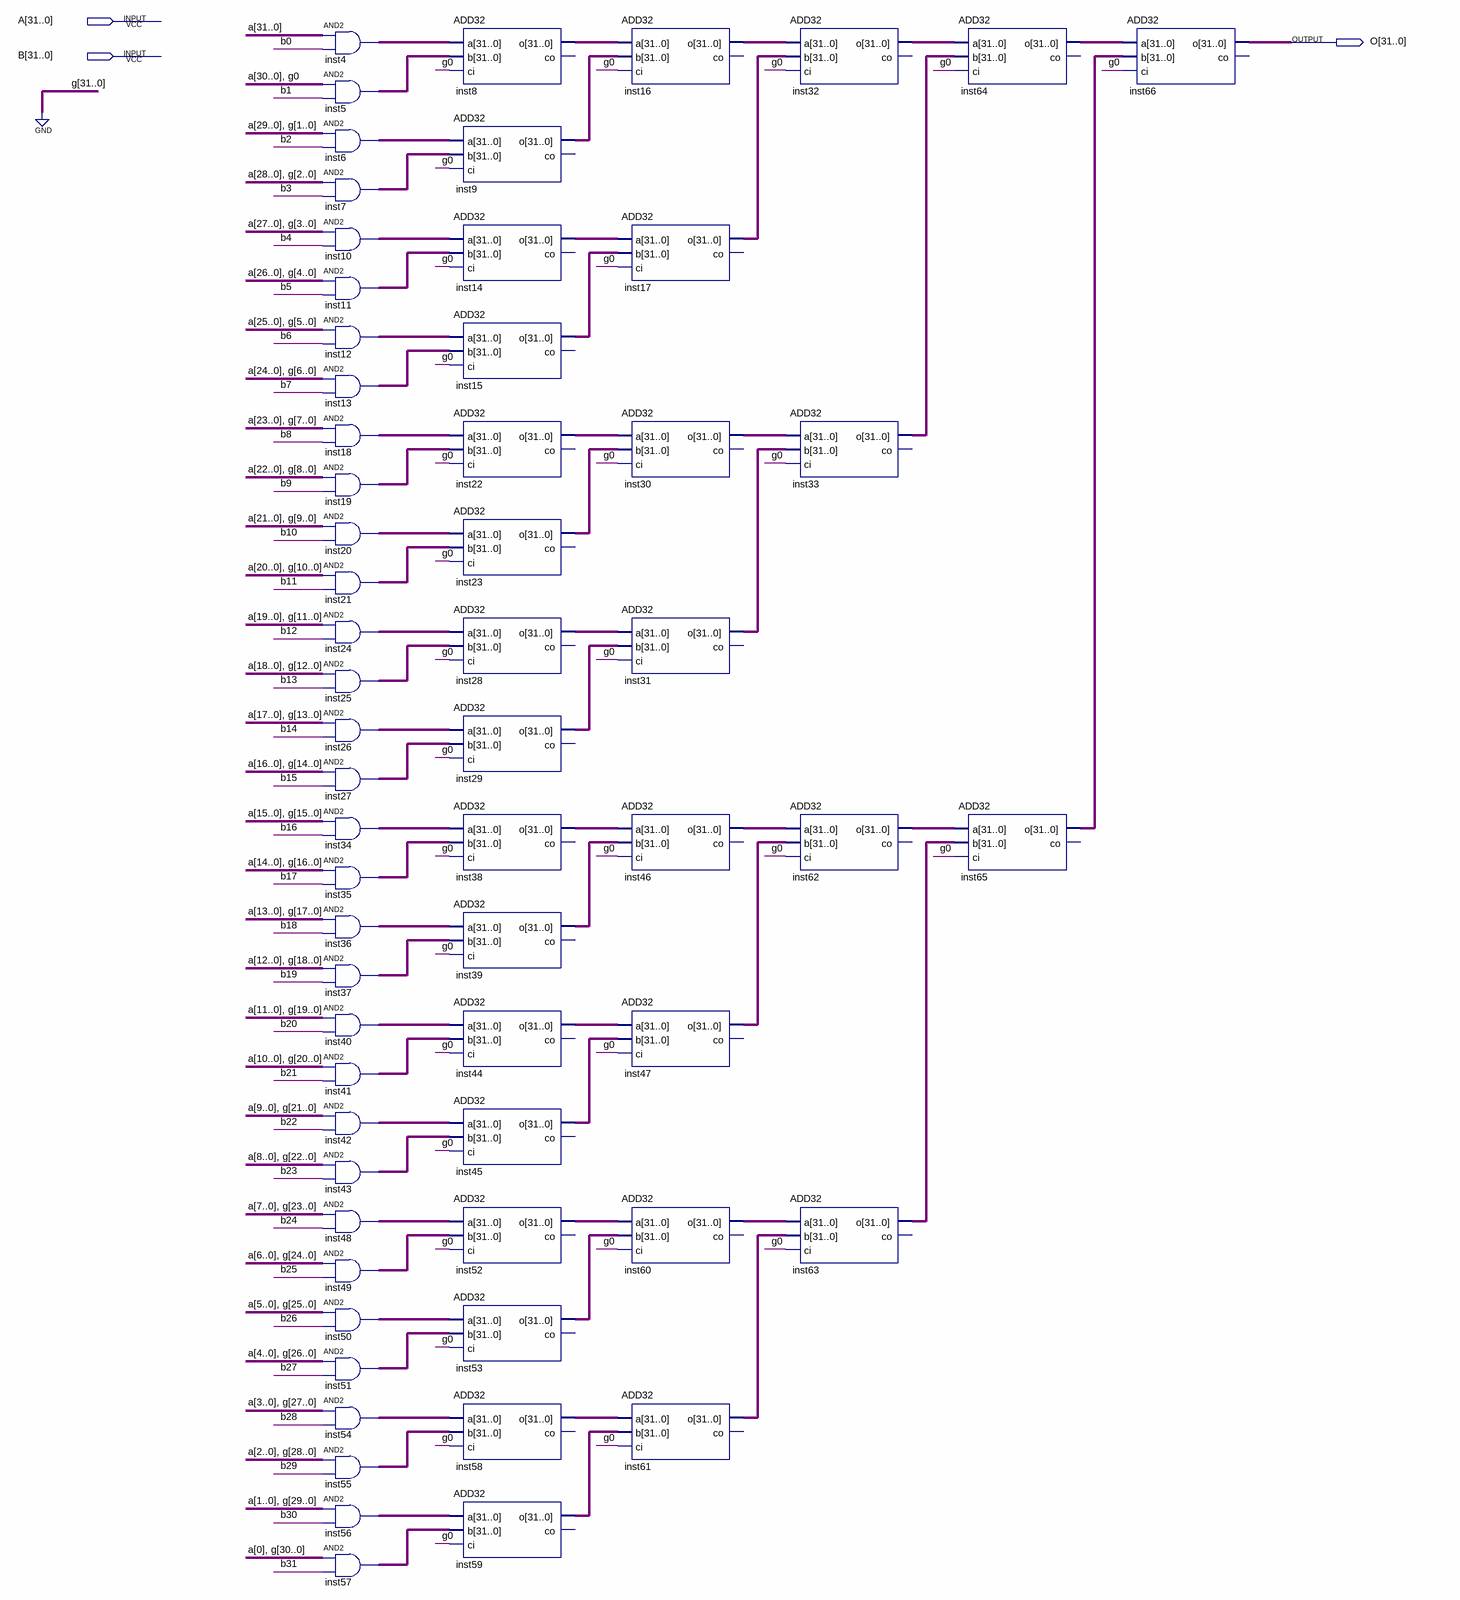
[diagram p0: schematic sheet]
// Quartus schematic MUL32.bdf as structural Verilog: 63 symbols, 3 pins
module MUL32 (
  input  [31:0] A,
  input  [31:0] B,
  output [31:0] O
);

  wire [31:0] inst4_out, inst5_out, inst6_out, inst7_out, inst8_o, inst9_o, inst10_out, inst11_out,
       inst12_out, inst13_out, inst14_o, inst15_o, inst16_o, inst17_o, inst18_out, inst19_out, inst20_out,
       inst21_out, inst22_o, inst23_o, inst24_out, inst25_out, inst26_out, inst27_out, inst28_o, inst29_o,
       inst30_o, inst31_o, inst32_o, inst33_o, inst34_out, inst35_out, inst36_out, inst37_out, inst38_o,
       inst39_o, inst40_out, inst41_out, inst42_out, inst43_out, inst44_o, inst45_o, inst46_o, inst47_o,
       inst48_out, inst49_out, inst50_out, inst51_out, inst52_o, inst53_o, inst54_out, inst55_out,
       inst56_out, inst57_out, inst58_o, inst59_o, inst60_o, inst61_o, inst62_o, inst63_o, inst64_o, inst65_o;

  assign inst4_out = A & {32{B[0]}};  // AND2 inst4, 32 bits wide
  assign inst5_out = {A[30:0], 1'b0} & {32{B[1]}};  // AND2 inst5, 32 bits wide
  assign inst6_out = {A[29:0], 2'b00} & {32{B[2]}};  // AND2 inst6, 32 bits wide
  assign inst7_out = {A[28:0], 3'b000} & {32{B[3]}};  // AND2 inst7, 32 bits wide
  assign inst10_out = {A[27:0], 4'b0000} & {32{B[4]}};  // AND2 inst10, 32 bits wide
  assign inst11_out = {A[26:0], {5{1'b0}}} & {32{B[5]}};  // AND2 inst11, 32 bits wide
  assign inst12_out = {A[25:0], {6{1'b0}}} & {32{B[6]}};  // AND2 inst12, 32 bits wide
  assign inst13_out = {A[24:0], {7{1'b0}}} & {32{B[7]}};  // AND2 inst13, 32 bits wide
  assign inst18_out = {A[23:0], {8{1'b0}}} & {32{B[8]}};  // AND2 inst18, 32 bits wide
  assign inst19_out = {A[22:0], {9{1'b0}}} & {32{B[9]}};  // AND2 inst19, 32 bits wide
  assign inst20_out = {A[21:0], {10{1'b0}}} & {32{B[10]}};  // AND2 inst20, 32 bits wide
  assign inst21_out = {A[20:0], {11{1'b0}}} & {32{B[11]}};  // AND2 inst21, 32 bits wide
  assign inst24_out = {A[19:0], {12{1'b0}}} & {32{B[12]}};  // AND2 inst24, 32 bits wide
  assign inst25_out = {A[18:0], {13{1'b0}}} & {32{B[13]}};  // AND2 inst25, 32 bits wide
  assign inst26_out = {A[17:0], {14{1'b0}}} & {32{B[14]}};  // AND2 inst26, 32 bits wide
  assign inst27_out = {A[16:0], {15{1'b0}}} & {32{B[15]}};  // AND2 inst27, 32 bits wide
  assign inst34_out = {A[15:0], {16{1'b0}}} & {32{B[16]}};  // AND2 inst34, 32 bits wide
  assign inst35_out = {A[14:0], {17{1'b0}}} & {32{B[17]}};  // AND2 inst35, 32 bits wide
  assign inst36_out = {A[13:0], {18{1'b0}}} & {32{B[18]}};  // AND2 inst36, 32 bits wide
  assign inst37_out = {A[12:0], {19{1'b0}}} & {32{B[19]}};  // AND2 inst37, 32 bits wide
  assign inst40_out = {A[11:0], {20{1'b0}}} & {32{B[20]}};  // AND2 inst40, 32 bits wide
  assign inst41_out = {A[10:0], {21{1'b0}}} & {32{B[21]}};  // AND2 inst41, 32 bits wide
  assign inst42_out = {A[9:0], {22{1'b0}}} & {32{B[22]}};  // AND2 inst42, 32 bits wide
  assign inst43_out = {A[8:0], {23{1'b0}}} & {32{B[23]}};  // AND2 inst43, 32 bits wide
  assign inst48_out = {A[7:0], {24{1'b0}}} & {32{B[24]}};  // AND2 inst48, 32 bits wide
  assign inst49_out = {A[6:0], {25{1'b0}}} & {32{B[25]}};  // AND2 inst49, 32 bits wide
  assign inst50_out = {A[5:0], {26{1'b0}}} & {32{B[26]}};  // AND2 inst50, 32 bits wide
  assign inst51_out = {A[4:0], {27{1'b0}}} & {32{B[27]}};  // AND2 inst51, 32 bits wide
  assign inst54_out = {A[3:0], {28{1'b0}}} & {32{B[28]}};  // AND2 inst54, 32 bits wide
  assign inst55_out = {A[2:0], {29{1'b0}}} & {32{B[29]}};  // AND2 inst55, 32 bits wide
  assign inst56_out = {A[1:0], {30{1'b0}}} & {32{B[30]}};  // AND2 inst56, 32 bits wide
  assign inst57_out = {A[0], {31{1'b0}}} & {32{B[31]}};  // AND2 inst57, 32 bits wide
  ADD32 inst8 (.a(inst4_out), .b(inst5_out), .ci(1'b0), .o(inst8_o));  // open: co
  ADD32 inst9 (.a(inst6_out), .b(inst7_out), .ci(1'b0), .o(inst9_o));  // open: co
  ADD32 inst14 (.a(inst10_out), .b(inst11_out), .ci(1'b0), .o(inst14_o));  // open: co
  ADD32 inst15 (.a(inst12_out), .b(inst13_out), .ci(1'b0), .o(inst15_o));  // open: co
  ADD32 inst22 (.a(inst18_out), .b(inst19_out), .ci(1'b0), .o(inst22_o));  // open: co
  ADD32 inst23 (.a(inst20_out), .b(inst21_out), .ci(1'b0), .o(inst23_o));  // open: co
  ADD32 inst28 (.a(inst24_out), .b(inst25_out), .ci(1'b0), .o(inst28_o));  // open: co
  ADD32 inst29 (.a(inst26_out), .b(inst27_out), .ci(1'b0), .o(inst29_o));  // open: co
  ADD32 inst38 (.a(inst34_out), .b(inst35_out), .ci(1'b0), .o(inst38_o));  // open: co
  ADD32 inst39 (.a(inst36_out), .b(inst37_out), .ci(1'b0), .o(inst39_o));  // open: co
  ADD32 inst44 (.a(inst40_out), .b(inst41_out), .ci(1'b0), .o(inst44_o));  // open: co
  ADD32 inst45 (.a(inst42_out), .b(inst43_out), .ci(1'b0), .o(inst45_o));  // open: co
  ADD32 inst52 (.a(inst48_out), .b(inst49_out), .ci(1'b0), .o(inst52_o));  // open: co
  ADD32 inst53 (.a(inst50_out), .b(inst51_out), .ci(1'b0), .o(inst53_o));  // open: co
  ADD32 inst58 (.a(inst54_out), .b(inst55_out), .ci(1'b0), .o(inst58_o));  // open: co
  ADD32 inst59 (.a(inst56_out), .b(inst57_out), .ci(1'b0), .o(inst59_o));  // open: co
  ADD32 inst16 (.a(inst8_o), .b(inst9_o), .ci(1'b0), .o(inst16_o));  // open: co
  ADD32 inst17 (.a(inst14_o), .b(inst15_o), .ci(1'b0), .o(inst17_o));  // open: co
  ADD32 inst30 (.a(inst22_o), .b(inst23_o), .ci(1'b0), .o(inst30_o));  // open: co
  ADD32 inst31 (.a(inst28_o), .b(inst29_o), .ci(1'b0), .o(inst31_o));  // open: co
  ADD32 inst46 (.a(inst38_o), .b(inst39_o), .ci(1'b0), .o(inst46_o));  // open: co
  ADD32 inst47 (.a(inst44_o), .b(inst45_o), .ci(1'b0), .o(inst47_o));  // open: co
  ADD32 inst60 (.a(inst52_o), .b(inst53_o), .ci(1'b0), .o(inst60_o));  // open: co
  ADD32 inst61 (.a(inst58_o), .b(inst59_o), .ci(1'b0), .o(inst61_o));  // open: co
  ADD32 inst32 (.a(inst16_o), .b(inst17_o), .ci(1'b0), .o(inst32_o));  // open: co
  ADD32 inst33 (.a(inst30_o), .b(inst31_o), .ci(1'b0), .o(inst33_o));  // open: co
  ADD32 inst62 (.a(inst46_o), .b(inst47_o), .ci(1'b0), .o(inst62_o));  // open: co
  ADD32 inst63 (.a(inst60_o), .b(inst61_o), .ci(1'b0), .o(inst63_o));  // open: co
  ADD32 inst64 (.a(inst32_o), .b(inst33_o), .ci(1'b0), .o(inst64_o));  // open: co
  ADD32 inst65 (.a(inst62_o), .b(inst63_o), .ci(1'b0), .o(inst65_o));  // open: co
  ADD32 inst66 (.a(inst64_o), .b(inst65_o), .ci(1'b0), .o(O));  // open: co
endmodule
